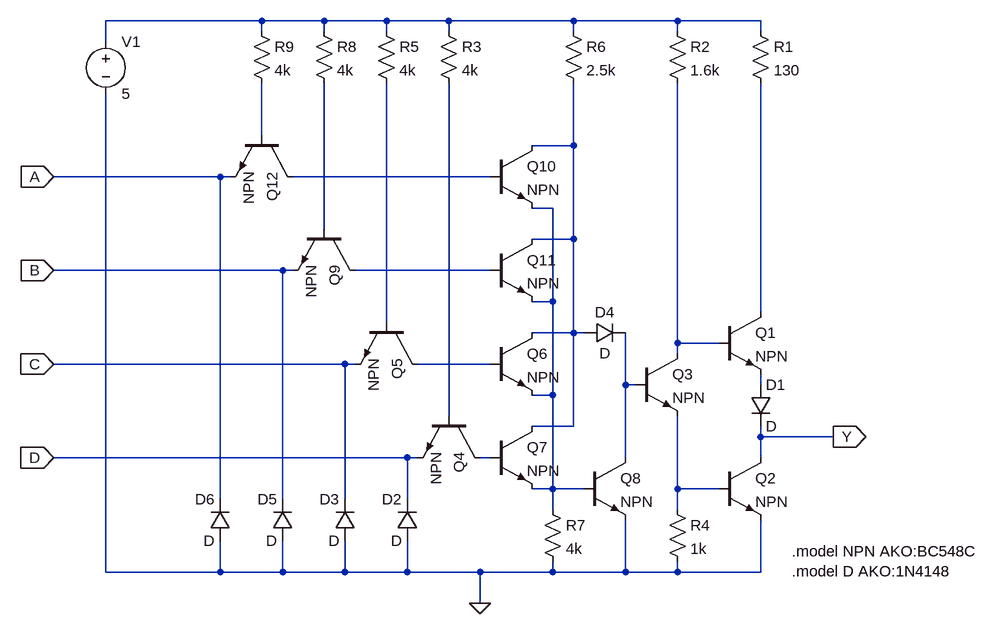
[diagram p0: schematic OR4.asc]
OR4.asc, the LTspice schematic file:
Version 4
SHEET 1 880 680
WIRE -320 -384 -560 -384
WIRE -224 -384 -320 -384
WIRE -128 -384 -224 -384
WIRE -32 -384 -128 -384
WIRE 160 -384 -32 -384
WIRE 320 -384 160 -384
WIRE 448 -384 320 -384
WIRE -320 -368 -320 -384
WIRE -224 -368 -224 -384
WIRE -128 -368 -128 -384
WIRE -32 -368 -32 -384
WIRE 160 -368 160 -384
WIRE 320 -368 320 -384
WIRE 448 -368 448 -384
WIRE -560 -352 -560 -384
WIRE -320 -208 -320 -288
WIRE 160 -192 160 -288
WIRE 160 -192 96 -192
WIRE -384 -144 -640 -144
WIRE -368 -144 -384 -144
WIRE 32 -144 -272 -144
WIRE 128 -96 96 -96
WIRE -224 -64 -224 -288
WIRE 160 -48 160 -192
WIRE 160 -48 96 -48
WIRE -288 0 -640 0
WIRE -272 0 -288 0
WIRE 32 0 -176 0
WIRE 128 48 128 -96
WIRE 128 48 96 48
WIRE 448 64 448 -288
WIRE -128 80 -128 -288
WIRE 160 96 160 -48
WIRE 160 96 96 96
WIRE 176 96 160 96
WIRE 320 112 320 -288
WIRE 384 112 320 112
WIRE 320 128 320 112
WIRE -192 144 -640 144
WIRE -176 144 -192 144
WIRE 32 144 -80 144
WIRE 240 176 240 96
WIRE 256 176 240 176
WIRE 448 176 448 160
WIRE 128 192 128 48
WIRE 128 192 96 192
WIRE -32 224 -32 -288
WIRE 160 240 160 96
WIRE 160 240 96 240
WIRE 448 256 448 240
WIRE 560 256 448 256
WIRE -96 288 -640 288
WIRE -80 288 -96 288
WIRE 32 288 16 288
WIRE 240 288 240 176
WIRE 448 288 448 256
WIRE 128 336 128 192
WIRE 128 336 96 336
WIRE 176 336 128 336
WIRE 320 336 320 224
WIRE 384 336 320 336
WIRE -384 352 -384 -144
WIRE -288 352 -288 0
WIRE -192 352 -192 144
WIRE -96 352 -96 288
WIRE 128 368 128 336
WIRE 320 368 320 336
WIRE -560 464 -560 -272
WIRE -384 464 -384 416
WIRE -384 464 -560 464
WIRE -288 464 -288 416
WIRE -288 464 -384 464
WIRE -192 464 -192 416
WIRE -192 464 -288 464
WIRE -96 464 -96 416
WIRE -96 464 -192 464
WIRE 16 464 -96 464
WIRE 128 464 128 448
WIRE 128 464 16 464
WIRE 240 464 240 384
WIRE 240 464 128 464
WIRE 320 464 320 448
WIRE 320 464 240 464
WIRE 448 464 448 384
WIRE 448 464 320 464
WIRE 16 512 16 464
FLAG 16 512 0
FLAG -640 288 D
IOPIN -640 288 In
FLAG 560 256 Y
IOPIN 560 256 Out
FLAG -640 144 C
IOPIN -640 144 In
FLAG -640 0 B
IOPIN -640 0 In
FLAG -640 -144 A
IOPIN -640 -144 In
SYMBOL npn 384 64 R0
SYMATTR InstName Q1
SYMBOL npn 384 288 R0
SYMATTR InstName Q2
SYMBOL npn 256 128 R0
SYMATTR InstName Q3
SYMBOL npn 16 224 R90
SYMATTR InstName Q4
SYMBOL res 432 -384 R0
SYMATTR InstName R1
SYMATTR Value 130
SYMBOL res 304 -384 R0
SYMATTR InstName R2
SYMATTR Value 1.6k
SYMBOL res -48 -384 R0
SYMATTR InstName R3
SYMATTR Value 4k
SYMBOL res 304 352 R0
SYMATTR InstName R4
SYMATTR Value 1k
SYMBOL diode 432 176 R0
SYMATTR InstName D1
SYMBOL diode -80 416 R180
WINDOW 0 24 64 Left 2
WINDOW 3 24 0 Left 2
SYMATTR InstName D2
SYMBOL voltage -560 -368 R0
WINDOW 123 0 0 Left 2
WINDOW 39 0 0 Left 2
SYMATTR InstName V1
SYMATTR Value 5
SYMBOL npn -80 80 R90
SYMATTR InstName Q5
SYMBOL diode -176 416 R180
WINDOW 0 24 64 Left 2
WINDOW 3 24 0 Left 2
SYMATTR InstName D3
SYMBOL res -144 -384 R0
SYMATTR InstName R5
SYMATTR Value 4k
SYMBOL res 144 -384 R0
SYMATTR InstName R6
SYMATTR Value 2.5k
SYMBOL diode 176 112 R270
WINDOW 0 32 32 VTop 2
WINDOW 3 0 32 VBottom 2
SYMATTR InstName D4
SYMBOL npn 32 96 R0
SYMATTR InstName Q6
SYMBOL npn 32 240 R0
SYMATTR InstName Q7
SYMBOL npn 176 288 R0
SYMATTR InstName Q8
SYMBOL res 112 352 R0
SYMATTR InstName R7
SYMATTR Value 4k
SYMBOL npn -176 -64 R90
SYMATTR InstName Q9
SYMBOL npn 32 -192 R0
SYMATTR InstName Q10
SYMBOL npn 32 -48 R0
SYMATTR InstName Q11
SYMBOL npn -272 -208 R90
SYMATTR InstName Q12
SYMBOL res -240 -384 R0
SYMATTR InstName R8
SYMATTR Value 4k
SYMBOL res -336 -384 R0
SYMATTR InstName R9
SYMATTR Value 4k
SYMBOL diode -272 416 R180
WINDOW 0 24 64 Left 2
WINDOW 3 24 0 Left 2
SYMATTR InstName D5
SYMBOL diode -368 416 R180
WINDOW 0 24 64 Left 2
WINDOW 3 24 0 Left 2
SYMATTR InstName D6
TEXT 496 432 Left 2 !.model NPN AKO:BC548C\n.model D AKO:1N4148

The netlist it stands for:
* OR4.asc
Q1 N008 N010 N013 0 NPN
Q2 Y N016 0 0 NPN
Q3 N010 N012 N016 0 NPN
Q4 N015 N014 D 0 NPN
R1 N001 N008 130
R2 N001 N010 1.6k
R3 N001 N014 4k
R4 N016 0 1k
D1 N013 Y D
D2 0 D D
V1 N001 0 5
Q5 N011 N009 C 0 NPN
D3 0 C D
R5 N001 N009 4k
R6 N001 N003 2.5k
D4 N003 N012 D
Q6 N003 N011 N005 0 NPN
Q7 N003 N015 N005 0 NPN
Q8 N012 N005 0 0 NPN
R7 N005 0 4k
Q9 N007 N006 B 0 NPN
Q10 N003 N004 N005 0 NPN
Q11 N003 N007 N005 0 NPN
Q12 N004 N002 A 0 NPN
R8 N001 N006 4k
R9 N001 N002 4k
D5 0 B D
D6 0 A D
.model D D
.lib standard.dio
.model NPN NPN
.model PNP PNP
.lib standard.bjt
.model NPN AKO:BC548C
.model D AKO:1N4148
.backanno
.end